# Altium schematic sheet 原理图.SchDoc
size A4
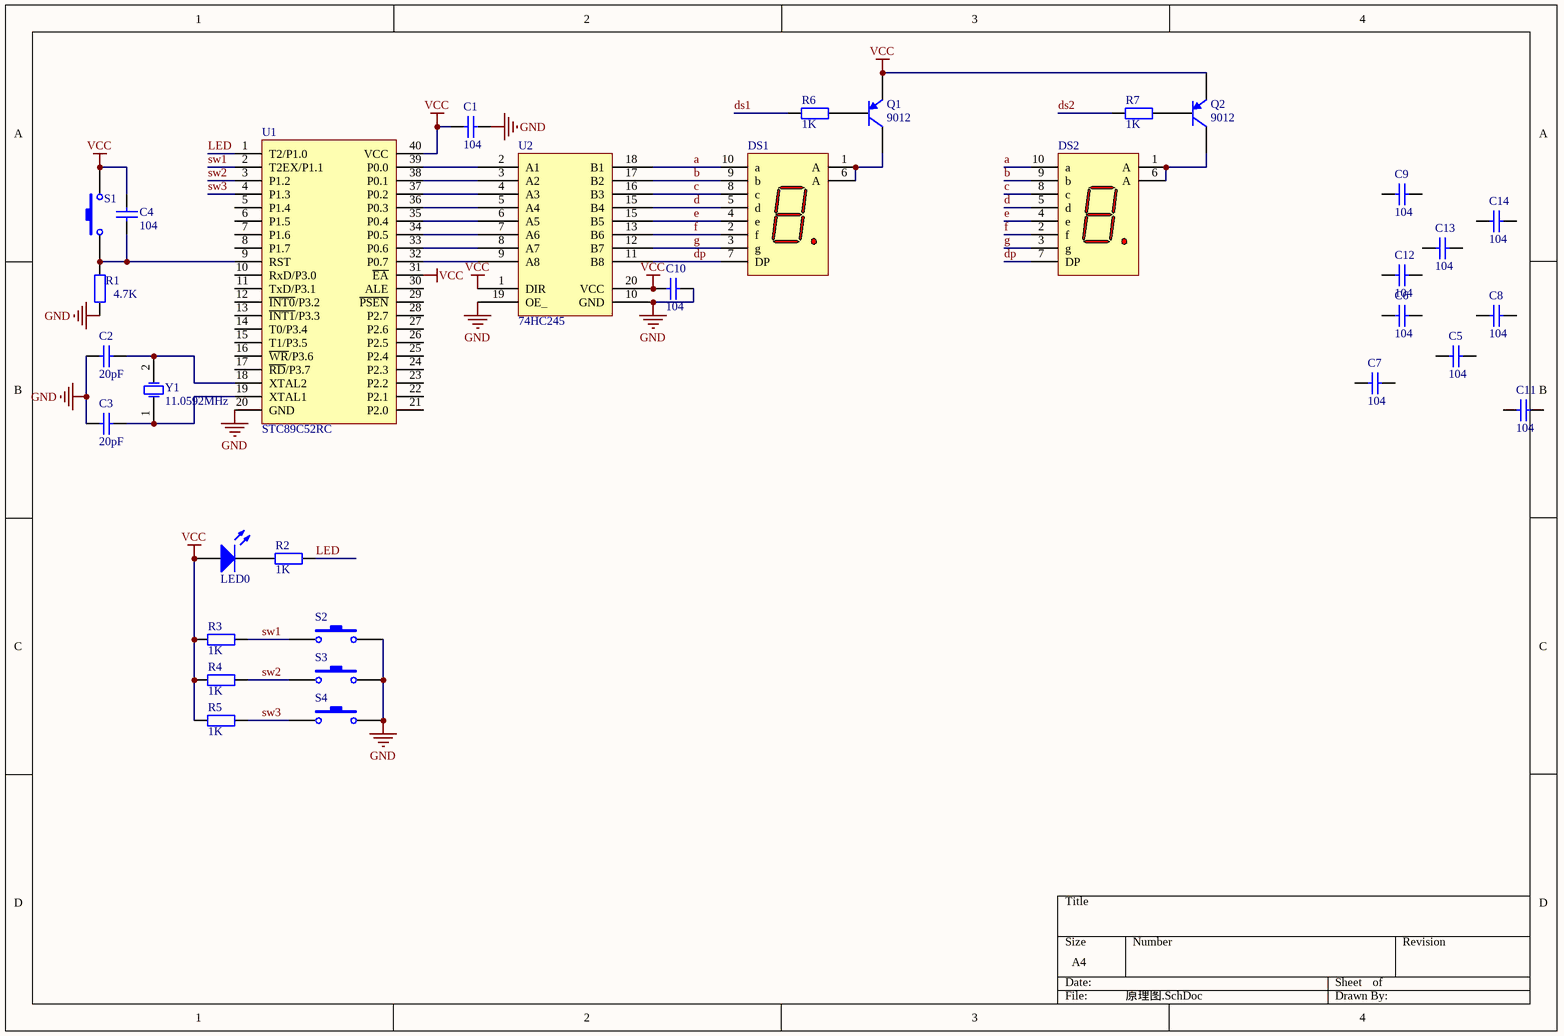
[diagram p0: 原理图.SchDoc]

## Parts
C1  value 104  [RAD-0.3]  (hidden comment: Cap)
C2  value 20pF  [RAD-0.3]  (hidden comment: Cap)
C3  value 20pF  [RAD-0.3]  (hidden comment: Cap)
C4  value 104  [RAD-0.3]  (hidden comment: Cap)
C5  value 104  [RAD-0.3]  (hidden comment: Cap)
C6  value 104  [RAD-0.3]  (hidden comment: Cap)
C7  value 104  [RAD-0.3]  (hidden comment: Cap)
C8  value 104  [RAD-0.3]  (hidden comment: Cap)
C9  value 104  [RAD-0.3]  (hidden comment: Cap)
C10  value 104  [RAD-0.3]  (hidden comment: Cap)
C11  value 104  [RAD-0.3]  (hidden comment: Cap)
C12  value 104  [RAD-0.3]  (hidden comment: Cap)
C13  value 104  [RAD-0.3]  (hidden comment: Cap)
C14  value 104  [RAD-0.3]  (hidden comment: Cap)
D1  LED0  [LED-0]
DS1  Dpy Red-CA  [A]  (value not drawn)
DS2  Dpy Red-CA  [A]  (value not drawn)
Q1  9012  [SOT-23B_N]
Q2  9012  [SOT-23B_N]
R1  value 4.7K  [AXIAL-0.4]  (hidden comment: Res2)
R2  value 1K  [AXIAL-0.4]  (hidden comment: Res2)
R3  value 1K  [AXIAL-0.4]  (hidden comment: Res2)
R4  value 1K  [AXIAL-0.4]  (hidden comment: Res2)
R5  value 1K  [AXIAL-0.4]  (hidden comment: Res2)
R6  value 1K  [AXIAL-0.4]  (hidden comment: Res2)
R7  value 1K  [AXIAL-0.4]  (hidden comment: Res2)
S1  SW-PB  [SPST-2]  (value not drawn)
S2  SW-PB  [SPST-2]  (value not drawn)
S3  SW-PB  [SPST-2]  (value not drawn)
S4  SW-PB  [SPST-2]  (value not drawn)
U1  STC89C52RC  [DIP40-600]
U2  74HC245
Y1  11.0592MHz  [R38]

## Nets
GND: C1.2 C2.1 C3.1 C10.2 R1.1 S2.2 S3.2 S4.2 U1.20(GND) U2.10(GND) U2.19(OE_)
VCC: C1.1 C4.2 C10.1 D1.1(A) Q1.3(E) Q2.3(E) R3.1 R4.1 R5.1 S1.2 U1.31(~{EA}) U1.40(VCC) U2.1(DIR) U2.20(VCC)
a: DS1.10(a) DS2.10(a) U2.18(B1)
b: DS1.9(b) DS2.9(b) U2.17(B2)
c: DS1.8(c) DS2.8(c) U2.16(B3)
d: DS1.5(d) DS2.5(d) U2.15(B4)
dp: DS1.7(DP) DS2.7(DP) U2.11(B8)
ds1: R6.1
ds2: R7.1
e: DS1.4(e) DS2.4(e) U2.15(B5)
f: DS1.2(f) DS2.2(f) U2.13(B6)
g: DS1.3(g) DS2.3(g) U2.12(B7)
LED: R2.2 U1.1(T2/P1.0)
sw1: R3.2 S2.1 U1.2(T2EX/P1.1)
sw2: R4.2 S3.1 U1.3(P1.2)
sw3: R5.2 S4.1 U1.4(P1.3)
NetC2_2: C2.2 U1.18(XTAL2) Y1.2(OSC2)
NetC3_2: C3.2 U1.19(XTAL1) Y1.1(OSC1)
NetC4_1: C4.1 R1.2 S1.1 U1.9(RST)
NetD1_2: D1.2(K) R2.1
NetDS1_1: DS1.1(A) DS1.6(A) Q1.1(C)
NetDS2_1: DS2.1(A) DS2.6(A) Q2.1(C)
NetQ1_2: Q1.2(B) R6.2
NetQ2_2: Q2.2(B) R7.2
NetU1_32: U1.32(P0.7) U2.9(A8)
NetU1_33: U1.33(P0.6) U2.8(A7)
NetU1_34: U1.34(P0.5) U2.7(A6)
NetU1_35: U1.35(P0.4) U2.6(A5)
NetU1_36: U1.36(P0.3) U2.5(A4)
NetU1_37: U1.37(P0.2) U2.4(A3)
NetU1_38: U1.38(P0.1) U2.3(A2)
NetU1_39: U1.39(P0.0) U2.2(A1)

Not connected (* = marked no-connect by the designer): C5 1 2; C6 1 2; C7 1 2; C8 1 2; C9 1 2; C11 1 2; C12 1 2; C13 1 2; C14 1 2; U1 5(P1.4) 6(P1.5) 7(P1.6) 8(P1.7) 10(RxD/P3.0) 11(TxD/P3.1) 12(~{INT0}/P3.2) 13(~{INT1}/P3.3) 14(T0/P3.4) 15(T1/P3.5) 16(~{WR}/P3.6) 17(~{RD}/P3.7) 21(P2.0) 22(P2.1) 23(P2.2) 24(P2.3) 25(P2.4) 26(P2.5) 27(P2.6) 28(P2.7) 29(~{PSEN}) 30(ALE)

## Library data of the parts
C1-C14 = Cap: Capacitor; Published: 8-Jun-2000; LatestRevisionDate: 17-Jul-2002; LatestRevisionNote: Re-released for DXP Platform.; PackageReference: RAD-0.3; Publisher: Altium Limited; PackageDescription: Radial Cap, Thru-Hole; 2 Leads; 0.3 in Pin Spacing
D1 = LED0: Typical INFRARED GaAs LED; Published: 8-Jun-2000; LatestRevisionDate: 08-Jul-2005; LatestRevisionNote: Mech Layer 1 removed.; PackageReference: LED-0; Publisher: Altium Limited; PackageDescription: LED; 2 Leads
DS1 DS2 = Dpy Red-CA: 7.62 mm Black Surface HER 7-Segment Display: CA, RH DP; MinimumIntensity: 360 ucd; Note: IF = 5 mA; Colour: High Efficiency Red (HER); Note: Pins 1 and 6 are redundant Anodes.; Published: 8-Jun-2000; LatestRevisionDate: 17-Dec-2003; LatestRevisionNote: Schematic revised, PCB Footprint replaced.; DatasheetVersion: 19-Feb-2002; PackageVersion: 11-Feb-2002; PackageReference: A; Publisher: Altium Limited; PackageDescription: LED, 7-Segment Display, 7.62 mm, RHD; 10 Leads; Row Space 5.08 mm; Pitch 2.54 mm; ComponentLink1Description: Manufacturer Link; ComponentLink1URL: http://www.agilent.com/
Q1 Q2 = PNP: PNP Bipolar Transistor; Published: 8-Jun-2000; LatestRevisionDate: 29-May-2009; LatestRevisionNote: IPC-7351 Footprint Added.; PackageVersion: Aug-1999; PackageReference: SOT-23B; Publisher: Altium Limited; PackageDescription: 3-Pin SOT-23 Package 0.95 mm Pitch, 2.4 mm Lead Span
R1-R7 = Res2: Resistor; Published: 8-Jun-2000; LatestRevisionDate: 17-Jul-2002; LatestRevisionNote: Re-released for DXP Platform.; PackageReference: AXIAL-0.4; Publisher: Altium Limited; PackageDescription: Axial Device, Thru-Hole; 2 Leads; 0.4 in Pin Spacing
S1-S4 = SW-PB: Switch; Published: 24-Mar-1999; LatestRevisionDate: 17-Jul-2002; LatestRevisionNote: Re-released for DXP Platform.; PackageReference: SPST-2; Publisher: Altium Limited; PackageDescription: Switch; 2 Leads
U1 = STC89C52RC: STC单片机; 版权归属: 源创客; BOM名称: STC单片机; 学习资源: www.ooocke.com
Y1 = XTAL: Crystal Oscillator; Published: 8-Jun-2000; LatestRevisionDate: 17-Jul-2002; LatestRevisionNote: Re-released for DXP Platform.; PackageReference: R38; Publisher: Altium Limited; PackageDescription: Crystal, Thru-Hole; 2 Leads; Body 3.1 x 8.2 mm (Dia.xH)